# Altium schematic sheet MPU.SchDoc
size A4; SheetNumber: 1; SheetTotal: 11
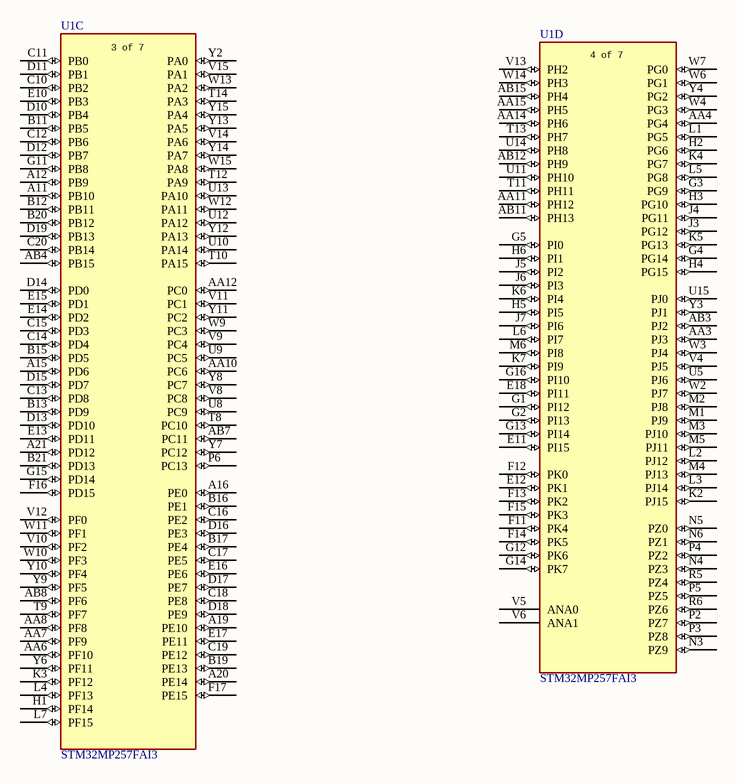
[diagram p0: MPU.SchDoc]

## Parts
U1  STM32MP257FAI3  [TFBGA436_STM]  (parts C,D of 8)

## Nets

Not connected (* = marked no-connect by the designer): U1 A11(PB10) A12(PB9) A15(PD6) A16(PE0) A19(PE10) A20(PE14) A21(PD12) AA3(PJ3) AA4(PG4) AA6(PF10) AA7(PF9) AA8(PF8) AA10(PC6) AA11(PH12) AA12(PC0) AA14(PH6) AA15(PH5) AB3(PJ2) AB4(PB15) AB7(PC11) AB8(PF6) AB11(PH13) AB12(PH9) AB15(PH4) B11(PB5) B12(PB11) B13(PD9) B15(PD5) B16(PE1) B17(PE4) B19(PE13) B20(PB12) B21(PD13) C10(PB2) C11(PB0) C12(PB6) C13(PD8) C14(PD4) C15(PD3) C16(PE2) C17(PE5) C18(PE8) C19(PE12) C20(PB14) D10(PB4) D11(PB1) D12(PB7) D13(PD10) D14(PD0) D15(PD7) D16(PE3) D17(PE7) D18(PE9) D19(PB13) E10(PB3) E11(PI15) E12(PK1) E13(PD11) E14(PD2) E15(PD1) E16(PE6) E17(PE11) E18(PI11) F11(PK4) F12(PK0) F13(PK2) F14(PK5) F15(PK3) F16(PD15) F17(PE15) G1(PI12) G2(PI13) G3(PG9) G4(PG14) G5(PI0) G11(PB8) G12(PK6) G13(PI14) G14(PK7) G15(PD14) G16(PI10) H1(PF14) H2(PG6) H3(PG10) H4(PG15) H5(PI5) H6(PI1) J3(PG12) J4(PG11) J5(PI2) J6(PI3) J7(PI6) K2(PJ15) K3(PF12) K4(PG7) K5(PG13) K6(PI4) K7(PI9) L1(PG5) L2(PJ12) L3(PJ14) L4(PF13) L5(PG8) L6(PI7) L7(PF15) M1(PJ9) M2(PJ8) M3(PJ10) M4(PJ13) M5(PJ11) M6(PI8) N3(PZ9) N4(PZ3) N5(PZ0) N6(PZ1) P2(PZ7) P3(PZ8) P4(PZ2) P5(PZ5) P6(PC13) R5(PZ4) R6(PZ6) T8(PC10) T9(PF7) T10(PA15) T11(PH11) T12(PA9) T13(PH7) T14(PA3) U5(PJ6) U8(PC9) U9(PC5) U10(PA14) U11(PH10) U12(PA12) U13(PA10) U14(PH8) U15(PJ0) V4(PJ5) V5(ANA0) V6(ANA1) V8(PC8) V9(PC4) V10(PF2) V11(PC1) V12(PF0) V13(PH2) V14(PA6) V15(PA1) W2(PJ7) W3(PJ4) W4(PG3) W6(PG1) W7(PG0) W9(PC3) W10(PF3) W11(PF1) W12(PA11) W13(PA2) W14(PH3) W15(PA8) Y2(PA0) Y3(PJ1) Y4(PG2) Y6(PF11) Y7(PC12) Y8(PC7) Y9(PF5) Y10(PF4) Y11(PC2) Y12(PA13) Y13(PA5) Y14(PA7) Y15(PA4)

## Notes on the sheet
- (in symbol STM32MP257FAI3, part C) 3 of 7
- (in symbol STM32MP257FAI3, part D) 4 of 7

## Library data of the parts
U1 = STM32MP257FAI3: MPU with Dual Arm Cortex-A35 @1.5GHz, Cortex-M33 @400MHz, 3xEthernet (2+1 switch), 3xFD-CAN, LVDS/DSI, H.264, 3D GPU, AI/NN, Secure Boot, Cryptography, DRAM enc/dec, PKA; Manufacturer_Name: STMicroelectronics; Copyright: Copyright (C) 2025 Ultra Librarian. All rights reserved.; Manufacturer_Part_Number: STM32MP257FAI3; RefDes: RefDes; Type: Type